# EAGLE design Backplane (EAGLE 9.4.2)

## Sheet 1 of 4: Power Supply
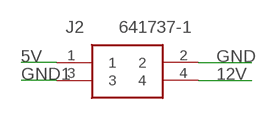
[diagram p0: schematic, sheet 1]

### Parts
J2  641737-1  [641737-1]

### Nets
5V: J2.1 ; also sheet 2,3,4
12V: J2.4
GND: J2.2 ; also sheet 2,3,4
GND1: J2.3

## Sheet 2 of 4: Master Hub
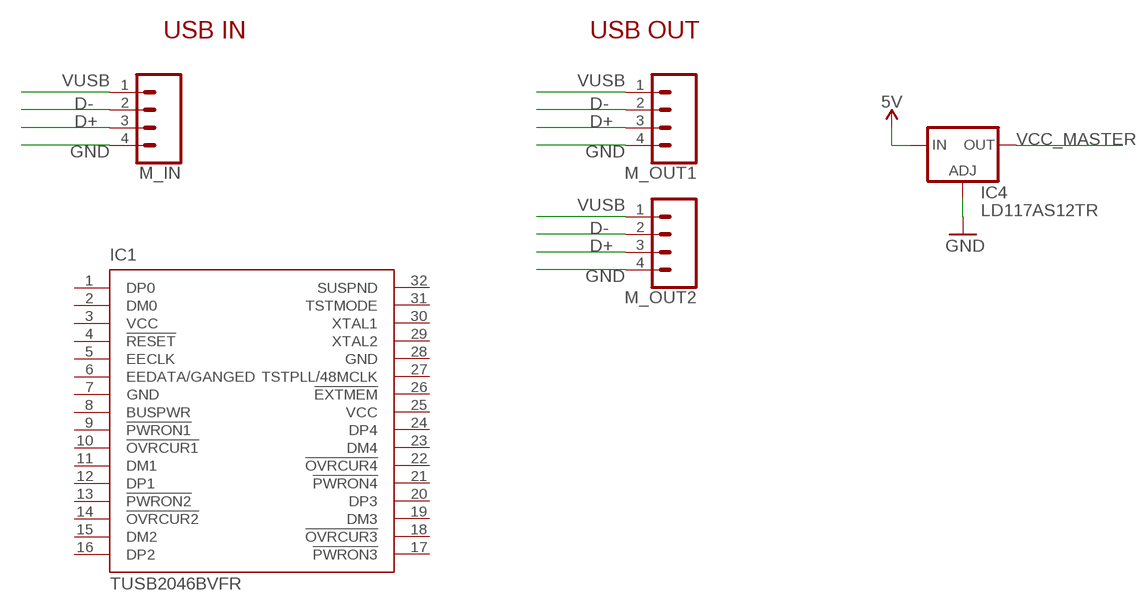
[diagram p1: schematic, sheet 2]

### Parts
IC1  TUSB2046BVFR  [VF_S-PQFP-G32]
IC4  LD117AS12TR  [SOT223]
M_IN  CONN_04JST-PTH-VERT  [JST-4-PTH-VERT]
M_OUT1  CONN_04JST-PTH-VERT  [JST-4-PTH-VERT]
M_OUT2  CONN_04JST-PTH-VERT  [JST-4-PTH-VERT]

### Nets
5V: IC4.3(IN) ; also sheet 1,3,4
D+: M_IN.3 M_OUT1.3 M_OUT2.3
D-: M_IN.2 M_OUT1.2 M_OUT2.2
GND: IC4.1(ADJ) M_IN.4 M_OUT1.4 M_OUT2.4 ; also sheet 1,3,4
VCC_MASTER: IC4.4(OUT)
VUSB: M_IN.1 M_OUT1.1 M_OUT2.1
Unconnected: IC1.1(DP0) IC1.2(DM0) IC1.4(!RESET) IC1.5(EECLK) IC1.6(EEDATA/GANGED) IC1.8(BUSPWR) IC1.9(!PWRON1) IC1.10(!OVRCUR1) IC1.11(DM1) IC1.12(DP1) IC1.13(!PWRON2) IC1.14(!OVRCUR2) IC1.15(DM2) IC1.16(DP2) IC1.17(!PWRON3) IC1.18(!OVRCUR3) IC1.19(DM3) IC1.20(DP3) IC1.21(!PWRON4) IC1.22(!OVRCUR4) IC1.23(DM4) IC1.24(DP4) IC1.26(!EXTMEM) IC1.27(TSTPLL/48MCLK) IC1.29(XTAL2) IC1.30(XTAL1) IC1.31(TSTMODE) IC1.32(SUSPND)

### Notes on the sheet
- USB IN | USB OUT

## Sheet 3 of 4: Hub 1
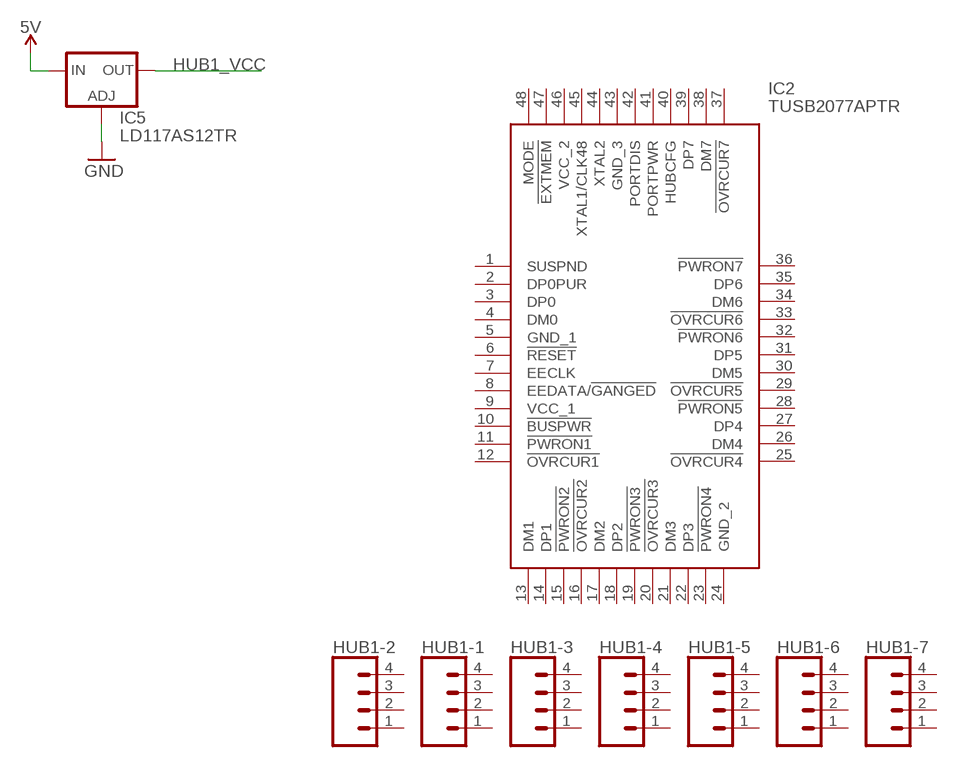
[diagram p2: schematic, sheet 3]

### Parts
HUB1-1  CONN_04JST-PTH-VERT  [JST-4-PTH-VERT]
HUB1-2  CONN_04JST-PTH-VERT  [JST-4-PTH-VERT]
HUB1-3  CONN_04JST-PTH-VERT  [JST-4-PTH-VERT]
HUB1-4  CONN_04JST-PTH-VERT  [JST-4-PTH-VERT]
HUB1-5  CONN_04JST-PTH-VERT  [JST-4-PTH-VERT]
HUB1-6  CONN_04JST-PTH-VERT  [JST-4-PTH-VERT]
HUB1-7  CONN_04JST-PTH-VERT  [JST-4-PTH-VERT]
IC2  TUSB2077APTR  [QFP50P900X900X160-48N]
IC5  LD117AS12TR  [SOT223]

### Nets
5V: IC5.3(IN) ; also sheet 1,2,4
GND: IC5.1(ADJ) ; also sheet 1,2,4
HUB1_VCC: IC5.4(OUT)
Unconnected: HUB1-1.1 HUB1-1.2 HUB1-1.3 HUB1-1.4 HUB1-2.1 HUB1-2.2 HUB1-2.3 HUB1-2.4 HUB1-3.1 HUB1-3.2 HUB1-3.3 HUB1-3.4 HUB1-4.1 HUB1-4.2 HUB1-4.3 HUB1-4.4 HUB1-5.1 HUB1-5.2 HUB1-5.3 HUB1-5.4 HUB1-6.1 HUB1-6.2 HUB1-6.3 HUB1-6.4 HUB1-7.1 HUB1-7.2 HUB1-7.3 HUB1-7.4 IC2.1(SUSPND) IC2.2(DP0PUR) IC2.3(DP0) IC2.4(DM0) IC2.5(GND_1) IC2.6(!RESET) IC2.7(EECLK) IC2.8(EEDATA/!GANGED) IC2.9(VCC_1) IC2.10(!BUSPWR) IC2.11(!PWRON1) IC2.12(!OVRCUR1) IC2.13(DM1) IC2.14(DP1) IC2.15(!PWRON2) IC2.16(!OVRCUR2) IC2.17(DM2) IC2.18(DP2) IC2.19(!PWRON3) IC2.20(!OVRCUR3) IC2.21(DM3) IC2.22(DP3) IC2.23(!PWRON4) IC2.24(GND_2) IC2.25(!OVRCUR4) IC2.26(DM4) IC2.27(DP4) IC2.28(!PWRON5) IC2.29(!OVRCUR5) IC2.30(DM5) IC2.31(DP5) IC2.32(!PWRON6) IC2.33(!OVRCUR6) IC2.34(DM6) IC2.35(DP6) IC2.36(!PWRON7) IC2.37(!OVRCUR7) IC2.38(DM7) IC2.39(DP7) IC2.40(HUBCFG) IC2.41(PORTPWR) IC2.42(PORTDIS) IC2.43(GND_3) IC2.44(XTAL2) IC2.45(XTAL1/CLK48) IC2.46(VCC_2) IC2.47(!EXTMEM) IC2.48(MODE)

## Sheet 4 of 4: Hub 2
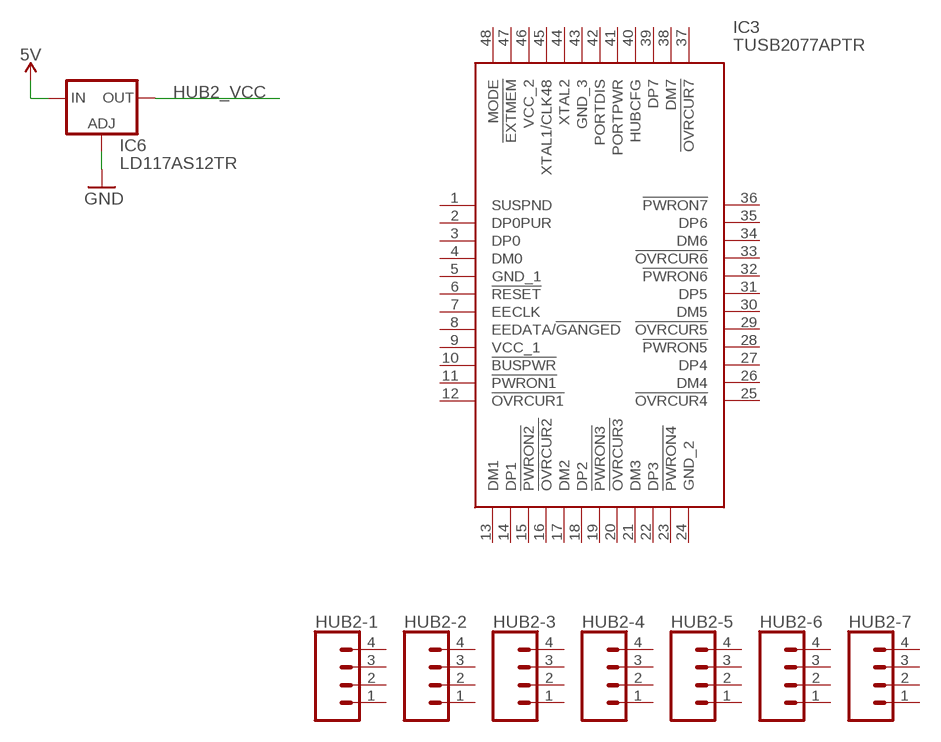
[diagram p3: schematic, sheet 4]

### Parts
HUB2-1  CONN_04JST-PTH-VERT  [JST-4-PTH-VERT]
HUB2-2  CONN_04JST-PTH-VERT  [JST-4-PTH-VERT]
HUB2-3  CONN_04JST-PTH-VERT  [JST-4-PTH-VERT]
HUB2-4  CONN_04JST-PTH-VERT  [JST-4-PTH-VERT]
HUB2-5  CONN_04JST-PTH-VERT  [JST-4-PTH-VERT]
HUB2-6  CONN_04JST-PTH-VERT  [JST-4-PTH-VERT]
HUB2-7  CONN_04JST-PTH-VERT  [JST-4-PTH-VERT]
IC3  TUSB2077APTR  [QFP50P900X900X160-48N]
IC6  LD117AS12TR  [SOT223]

### Nets
5V: IC6.3(IN) ; also sheet 1,2,3
GND: IC6.1(ADJ) ; also sheet 1,2,3
HUB2_VCC: IC6.4(OUT)
Unconnected: HUB2-1.1 HUB2-1.2 HUB2-1.3 HUB2-1.4 HUB2-2.1 HUB2-2.2 HUB2-2.3 HUB2-2.4 HUB2-3.1 HUB2-3.2 HUB2-3.3 HUB2-3.4 HUB2-4.1 HUB2-4.2 HUB2-4.3 HUB2-4.4 HUB2-5.1 HUB2-5.2 HUB2-5.3 HUB2-5.4 HUB2-6.1 HUB2-6.2 HUB2-6.3 HUB2-6.4 HUB2-7.1 HUB2-7.2 HUB2-7.3 HUB2-7.4 IC3.1(SUSPND) IC3.2(DP0PUR) IC3.3(DP0) IC3.4(DM0) IC3.5(GND_1) IC3.6(!RESET) IC3.7(EECLK) IC3.8(EEDATA/!GANGED) IC3.9(VCC_1) IC3.10(!BUSPWR) IC3.11(!PWRON1) IC3.12(!OVRCUR1) IC3.13(DM1) IC3.14(DP1) IC3.15(!PWRON2) IC3.16(!OVRCUR2) IC3.17(DM2) IC3.18(DP2) IC3.19(!PWRON3) IC3.20(!OVRCUR3) IC3.21(DM3) IC3.22(DP3) IC3.23(!PWRON4) IC3.24(GND_2) IC3.25(!OVRCUR4) IC3.26(DM4) IC3.27(DP4) IC3.28(!PWRON5) IC3.29(!OVRCUR5) IC3.30(DM5) IC3.31(DP5) IC3.32(!PWRON6) IC3.33(!OVRCUR6) IC3.34(DM6) IC3.35(DP6) IC3.36(!PWRON7) IC3.37(!OVRCUR7) IC3.38(DM7) IC3.39(DP7) IC3.40(HUBCFG) IC3.41(PORTPWR) IC3.42(PORTDIS) IC3.43(GND_3) IC3.44(XTAL2) IC3.45(XTAL1/CLK48) IC3.46(VCC_2) IC3.47(!EXTMEM) IC3.48(MODE)

## Power pins joined to a net without a drawn wire
GND: IC1.7(GND) IC1.28(GND)
VCC: IC1.3(VCC) IC1.25(VCC)

## Library data of the parts
HUB1-1-HUB1-7 HUB2-1-HUB2-7 M_IN M_OUT1 M_OUT2 = SparkFun-Connectors:CONN_04: Multi connection point. Often used as Generic Header-pin footprint for 0.1 inch spaced/style header connections On any of the 0.1 inch spaced packages, you can populate with these: Break Away Headers - Straight <https://www.sparkfun.com/products/116> (PRT-00116) Break Away Male Headers - Right Angle <https://www.sparkfun.com/products/553> (PRT-00553) Female Headers <https://www.sparkfun.com/products/115> (PRT-00115) Break Away Headers - Machine Pin <https://www.sparkfun.com/products/117> (PRT-00117) Break Away Female Headers - Swiss Machine Pin <https://www.sparkfun.com/products/743> (PRT-00743) For SCREWTERMINALS and SPRING TERMINALS visit here: Screw Terimnals on SparkFun.com <https://www.sparkfun.com/search/results?term=Screw+Terminals> (5mm/3.5mm/2.54mm spacing) This device is also useful as a general connection point to wire up your design to another part of your project. Our various solder wires solder well into these plated through hole pads. Hook-Up Wire - Assortment (Stranded, 22 AWG) <https://www.sparkfun.com/products/11375> (PRT-11375) Hook-Up Wire - Assortment (Solid Core, 22 AWG) <https://www.sparkfun.com/products/11367> (PRT-11367) View the entire wire category on our website here <https://www.sparkfun.com/categories/141> Special notes: Molex polarized connector foot print use with SKU : PRT-08231 with associated crimp pins and housings. 1MM SMD Version SKU: PRT-10208; PROD_ID: CONN-13251
IC1 = texas:TUSB2046B: 4-PORT HUB FOR THE UNIVERSAL SERIAL BUS WITH OPTIONAL SERIAL EEPROM INTERFACE Auto generated by make-symbol-device-package-bsdl.ulp Rev. 30 Source: http://focus.ti.com/lit/ds/symlink/tusb2046b.pdf; MF: TEXAS INSTRUMENTS; MPN: TUSB2046BVFR; OC_FARNELL: 1470507; OC_NEWARK: 77C1806
IC2 IC3 = SamacSys_Parts:TUSB2077APTR: 7-Port Full-Speed 12Mbps USB 2.0 Hub Source: Datasheet <http://www.ti.com/lit/gpn/TUSB2077A>; DESCRIPTION: 7-Port Full-Speed 12Mbps USB 2.0 Hub; HEIGHT: 1.6mm; MANUFACTURER_NAME: Texas Instruments; MANUFACTURER_PART_NUMBER: TUSB2077APTR; MOUSER_PART_NUMBER: 595-TUSB2077APTR; MOUSER_PRICE-STOCK: https://www.mouser.com/Search/Refine.aspx?Keyword=595-TUSB2077APTR
IC4-IC6 = v-reg:LD117A?*: Low drop fixed and adjustable positive voltage regulators 1 A Source: http://www.st.com/stonline/products/literature/ds/7194/ld1117axx.pdf
J2 = SamacSys_Parts:641737-1: 4w pcb mount R/A Pin Header Source: Datasheet <https://componentsearchengine.com/Datasheets/1/641737-1.pdf>; DESCRIPTION: 4w pcb mount R/A Pin Header; HEIGHT: mm; MANUFACTURER_NAME: TE Connectivity; MANUFACTURER_PART_NUMBER: 641737-1; MOUSER_PART_NUMBER: 571-6417371; MOUSER_PRICE-STOCK: https://www.mouser.com/Search/Refine.aspx?Keyword=571-6417371

## Board
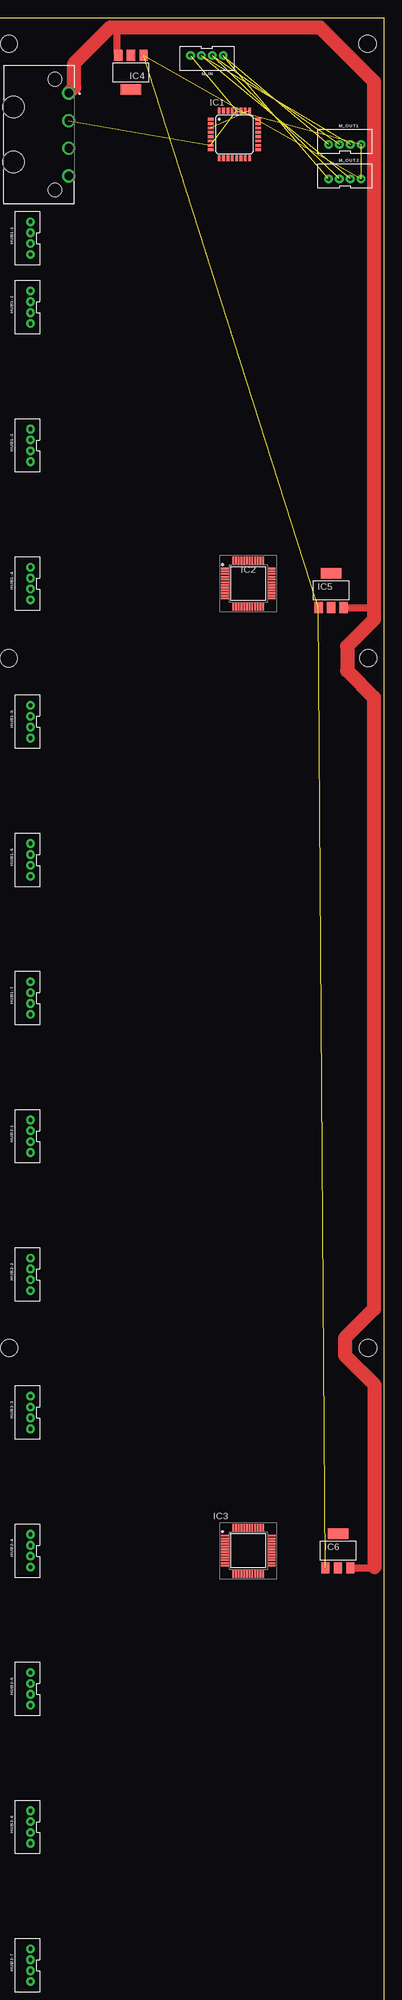
[diagram p4: board, top side]

No outline drawn. Coordinates in mm, seen from the top.
Copper layers (1*16): Top 0.035mm / dielectric 1.5mm / Bottom 0.035mm
Design rules "default": minimum track width 6mil, minimum drill 0.35mm, track to track 6mil, track to pad 6mil, pad to pad 6mil, via to via 6mil, smd to smd 6mil, copper to edge 40mil, drill to drill 6mil, minimum pad ring 10mil, minimum via ring 8mil, stop-mask expansion 4mil, vias tented up to drill 0mil, thermal gap 10mil
Holes 3.2 mm at 2.9,3.62 68.92,3.62 3,127.47 69.02,127.47 2.88,254.22 69.07,254.24 2.93,367.22 68.94,367.22
Milling: 8 lines

### Footprints (pad centres in the part's own frame; a part is rotated, then mirrored left to right if it is on the bottom)
JST-4-PTH-VERT = drill 0.7 pad 1.6: 1 -3,-0.55; 2 -1,-0.55; 3 1,-0.55; 4 3,-0.55
VF_S-PQFP-G32 = smd 1.05 x 0.5: 1 -4.375,2.8; 2 -4.375,2; 3 -4.375,1.2; 4 -4.375,0.4; 5 -4.375,-0.4; 6 -4.375,-1.2; 7 -4.375,-2; 8 -4.375,-2.8; 17 4.375,-2.8; 18 4.375,-2; 19 4.375,-1.2; 20 4.375,-0.4; 21 4.375,0.4; 22 4.375,1.2; 23 4.375,2; 24 4.375,2.8 | smd 0.5 x 1.05: 9 -2.8,-4.375; 10 -2,-4.375; 11 -1.2,-4.375; 12 -0.4,-4.375; 13 0.4,-4.375; 14 1.2,-4.375; 15 2,-4.375; 16 2.8,-4.375; 25 2.8,4.375; 26 2,4.375; 27 1.2,4.375; 28 0.4,4.375; 29 -0.4,4.375; 30 -1.2,4.375; 31 -2,4.375; 32 -2.8,4.375
QFP50P900X900X160-48N = smd 1.475 x 0.3: 1 -4.238,2.75; 2 -4.238,2.25; 3 -4.238,1.75; 4 -4.238,1.25; 5 -4.238,0.75; 6 -4.238,0.25; 7 -4.238,-0.25; 8 -4.238,-0.75; 9 -4.238,-1.25; 10 -4.238,-1.75; 11 -4.238,-2.25; 12 -4.238,-2.75; 25 4.238,-2.75; 26 4.238,-2.25; 27 4.238,-1.75; 28 4.238,-1.25; 29 4.238,-0.75; 30 4.238,-0.25; 31 4.238,0.25; 32 4.238,0.75; 33 4.238,1.25; 34 4.238,1.75; 35 4.238,2.25; 36 4.238,2.75 | smd 0.3 x 1.475: 13 -2.75,-4.238; 14 -2.25,-4.238; 15 -1.75,-4.238; 16 -1.25,-4.238; 17 -0.75,-4.238; 18 -0.25,-4.238; 19 0.25,-4.238; 20 0.75,-4.238; 21 1.25,-4.238; 22 1.75,-4.238; 23 2.25,-4.238; 24 2.75,-4.238; 37 2.75,4.238; 38 2.25,4.238; 39 1.75,4.238; 40 1.25,4.238; 41 0.75,4.238; 42 0.25,4.238; 43 -0.25,4.238; 44 -0.75,4.238; 45 -1.25,4.238; 46 -1.75,4.238; 47 -2.25,4.238; 48 -2.75,4.238
SOT223 = smd 1.5 x 2: 1 -2.3,-3.15; 2 0,-3.15; 3 2.3,-3.15 | smd 3.8 x 2: 4 0,3.15
641737-1 = drill 1.6 pad 2.4: 1 7.62,0; 2 2.54,0; 3 -2.54,0; 4 -7.62,0 | hole 2.54: -10.16,2.54; 10.16,2.54 | hole 4: -5.08,10.16; 5.08,10.16

### Placement (x,y rotation side)
HUB1-1  6.35,331.47 90 top
HUB1-2  6.35,318.77 90 top
HUB1-3  6.35,293.37 90 top
HUB1-4  6.35,267.97 90 top
HUB1-5  6.35,242.57 90 top
HUB1-6  6.35,217.17 90 top
HUB1-7  6.35,191.77 90 top
HUB2-1  6.35,166.37 90 top
HUB2-2  6.35,140.97 90 top
HUB2-3  6.35,115.57 90 top
HUB2-4  6.35,90.17 90 top
HUB2-5  6.35,64.77 90 top
HUB2-6  6.35,39.37 90 top
HUB2-7  6.35,13.97 90 top
IC1  44.45,350.52 0 top
IC2  46.99,267.97 0 top
IC3  46.99,90.17 0 top
IC4  25.4,361.95 180 top
IC5  62.23,266.7 0 top
IC6  63.5,90.17 0 top
J2  13.97,350.52 90 top
M_IN  39.37,364.49 180 top
M_OUT1  64.77,349.25 0 top
M_OUT2  64.77,342.9 0 top

### Tracks (layer width: path | path; a pad name or v marks a point on that pad's centre or on a via)
5V
  Top 1.27: IC4.3 22.86,365.34 22.86,370.2 | IC5.3 69.44,263.55 70.1,262.89 | IC6.3 70.13,87.02 70.23,87.12
  Top 2.54: J2.1 13.97,358.19 14.99,359.21 14.99,363.6 21.59,370.2 22.86,370.2 60.2,370.2 70.1,360.3 70.1,262.89 70.1,261.37 65.18,256.44 65.18,251.94 70.1,247.01 70.1,134.62 64.77,129.29 64.77,126.11 70.23,120.65 70.23,87.12
D+  (2 unrouted)
D-  (2 unrouted)
GND  (8 unrouted)
VCC  (1 unrouted)
VUSB  (2 unrouted)